# Altium project DAC_BREAKOUT.PrjPcb
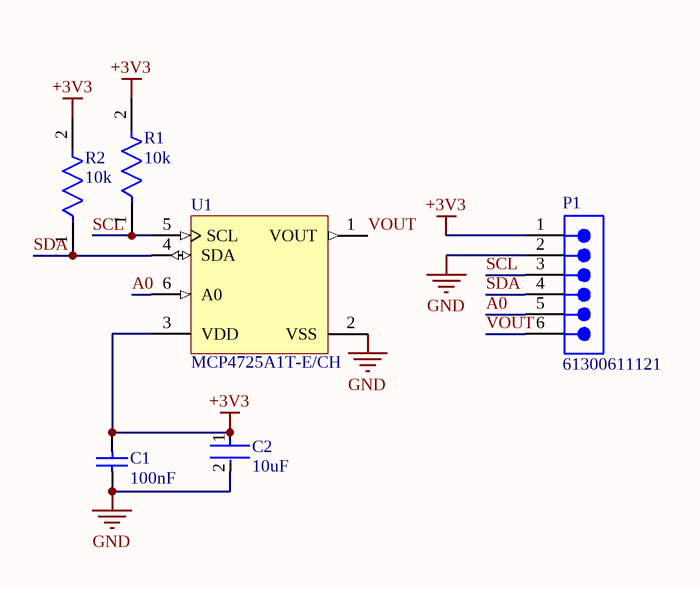
[diagram p0: DAC.SchDoc]
1 sheet, 6 parts. Net scope: global (net labels, ports and power ports of the same name join across sheets).
Board file: DAC.PcbDoc

## Sheet DAC.SchDoc
size A; SheetNumber: 1; SheetTotal: 1

### Parts
C1  100nF  [CAPC1050X55X23ML05T13]
C2  10uF  [FP-C0805C106J8RACAUTO-MFG]
P1  61300611121  [61300611121]
R1  10k  [FP-CRCW0402-C-e3-IPC_C]
R2  10k  [FP-CRCW0402-C-e3-IPC_C]
U1  MCP4725A1T-E/CH  [SOT-23-CH6_N]

### Nets
+3V3: C1.2 C2.1 P1.1 R1.2 R2.2 U1.3(VDD)
GND: C1.1 C2.2 P1.2 U1.2(VSS)
A0: P1.5 U1.6(A0)
SCL: P1.3 R1.1 U1.5(SCL)
SDA: P1.4 R2.1 U1.4(SDA)
VOUT: P1.6 U1.1(VOUT)

### Library data of the parts
C1 = CMP-2000-05439-1: Chip Capacitor, 100 nF, +/- 10%, 16 V, -55 to 125 degC, 0402 (1005 Metric), RoHS, Tape and Reel; Manufacturer: Samsung Electro-Mechanics; Capacitance: 100000pF; Dielectric: X7R; Rated Voltage: 16V; Case Size/Dimension: 0402; Tolerance (%): ±10%; Manufacturer URL: http://www.samsungsem.com/global/index.jsp; Datasheet URL: https://datasheet.ciiva.com/29198/458718-da-01-en-vs-kondensator-0402-29198423.pdf; Datasheet Version: Nov-10
C2 = CMP-03020-034708-1: CAP CER 10UF 10V X7R 0805; Tolerance: 5%; Mount: Surface Mount; Capacitance: 10uF; Voltage Rating: 10V; Max Operating Temperature: 125°C; Min Operating Temperature: -55°C; Case/Package: 0805; RoHS Compliant: Yes; Packaging: Tape and Reel; Case Code (Imperial): 0805; Case Code (Metric): 2012; Ratings: AEC-Q200
P1 = CMP-1502-01070-3: NexarPartId: 20084590; Current Rating: 3A; Pitch: 2.54mm; Gender: Male; Operating Supply Voltage: 250V; Connector Type: Male Pin; Number of Positions: 6; Contact Resistance: 20mΩ; Packaging: Bulk; Number of Pins: 6; Number of Rows: 1; Contact Plating: Gold; Lead Free: Lead Free; RoHS: Compliant; Contact Mating Length: 5.9944mm; Voltage Rating: 250V; REACH SVHC: Unknown; Contact Gender: Male; Housing Material: PBT; Min Operating Temperature: -40°C; Lead Pitch: 2.54mm; Mount: Through Hole; Number of Contacts: 6; Max Operating Temperature: 105°C; Contact Material: Copper; Orientation: Vertical; Termination: Through Hole; Color: Black; Height: 8.89mm
R1 R2 = CMP-02407-012085-1: RES 10K OHM 1% 1/16W 0402; Temperature Coefficient: 100ppm/°C; Power Rating: 62.5mW; Resistance: 10kR; Lead Free: Lead Free; Max Operating Temperature: 155°C; RoHS Compliant: Yes; Mount: Surface Mount; Min Operating Temperature: -55°C; Termination: Wraparound; Length: 1mm; Resistor Type: Thick Film; Contact Plating: Tin; Tolerance: 1%; Case/Package: Molded
U1 = CMP-0188-00759-2: 12-Bit Digital-to-Analog Converter with EEPROM Memory in SOT-23-6, 6-Pin SOT-23, Extended Temperature, Tape and Reel; RevisionNote: URLs added.; ComponentLink2Description: Datasheet; PackageDescription: 6-Lead Plastic Small Outline Transistor (CH) [SOT-23]; DatasheetVersion: revD, Jun-2009; ComponentLink1Description: Manufacturer URL; Code_IPC: SOT26A-6; ComponentLink3URL: http://www.microchip.com/stellent/groups/techpub_sg/documents/packagingspec/en012702.pdf; ComponentLink1URL: http://www.microchip.com/; ComponentLink3Description: Package Specification; PackageVersion: revBB, Aug-2009; ComponentLink2URL: http://ww1.microchip.com/downloads/en/DeviceDoc/22039d.pdf; PackageReference: SOT-23-CH6